# EAGLE design RoverWingPogoBed-V1 (EAGLE 9.2.2)

## Sheet 1 of 2
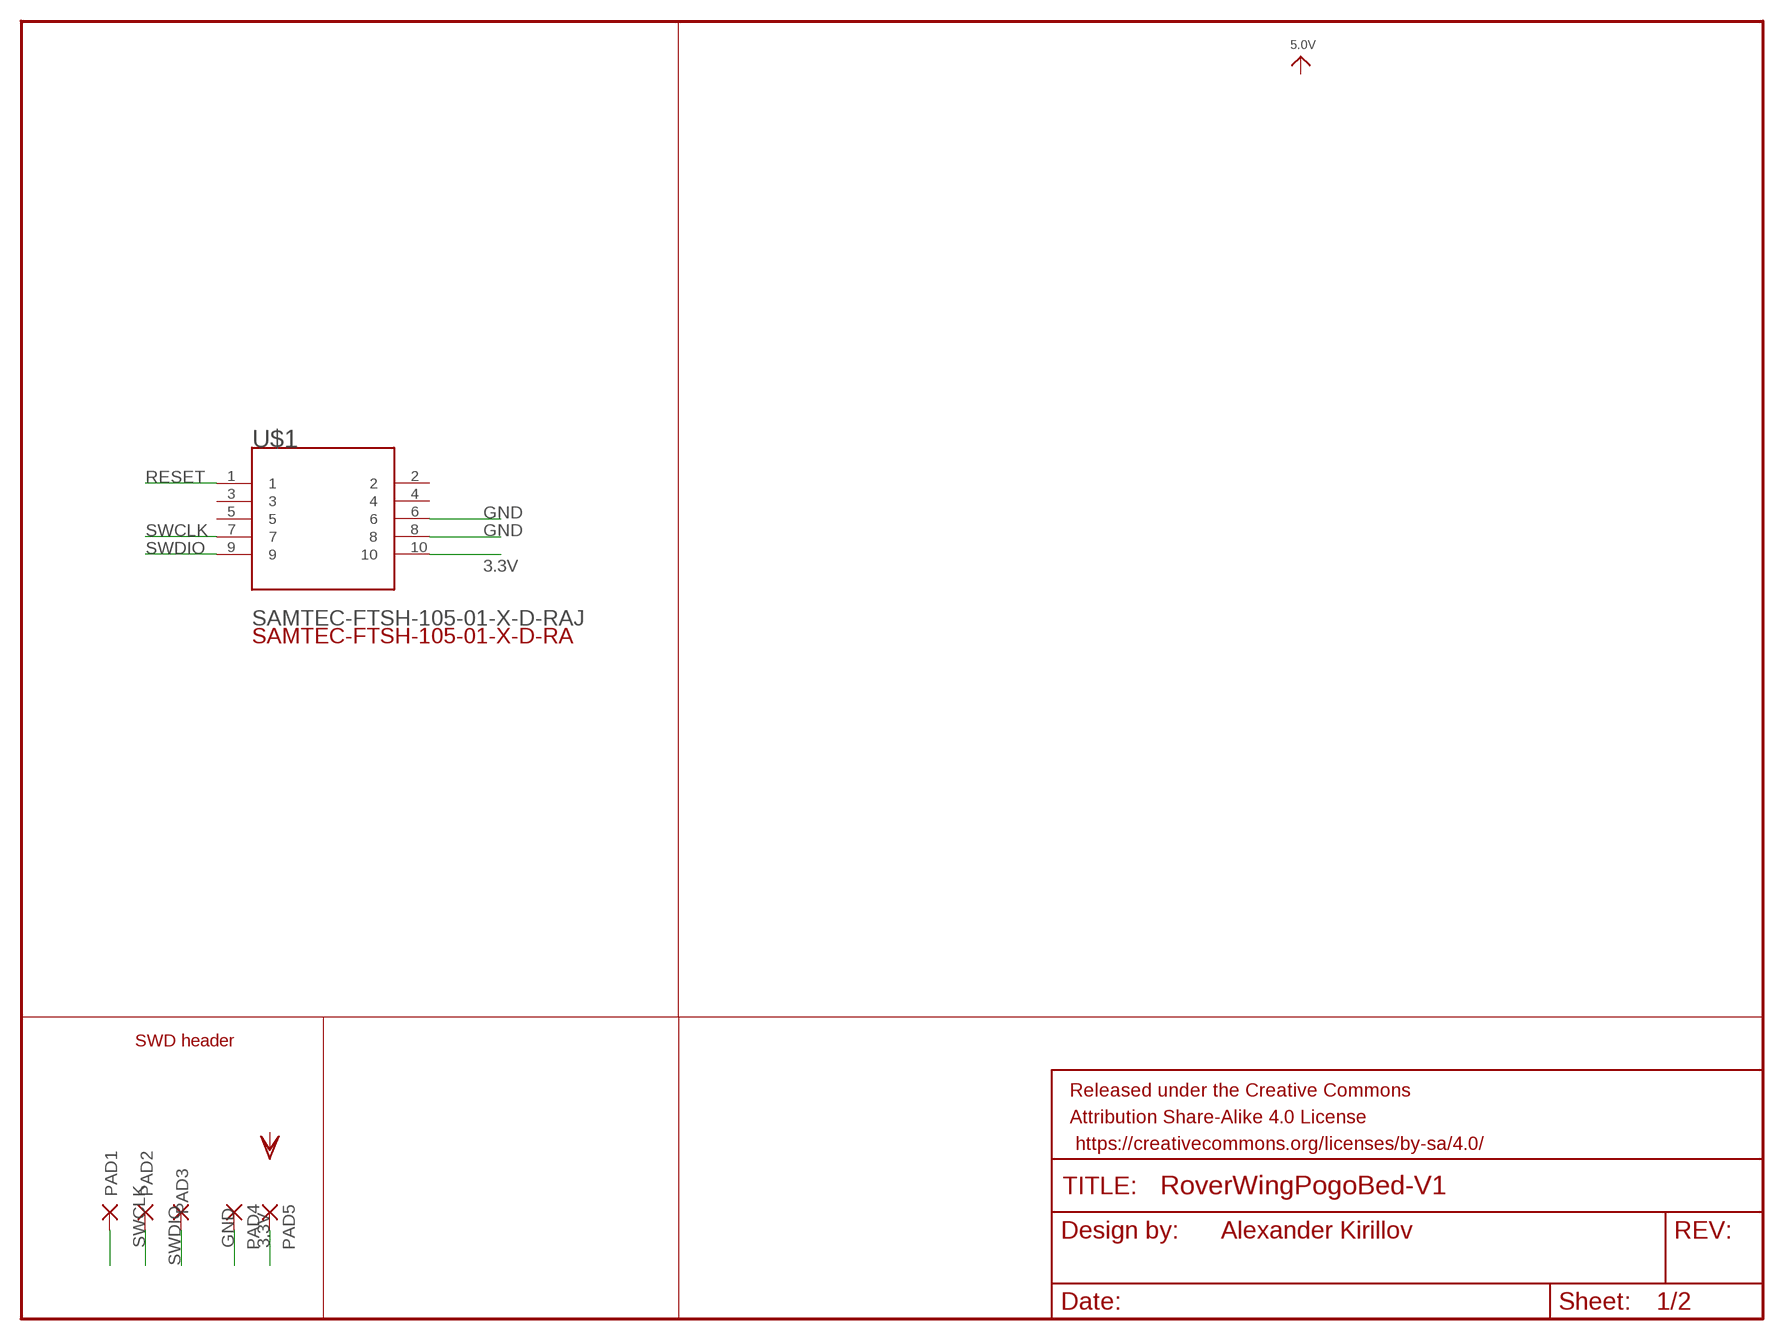
[diagram p0: schematic, sheet 1]

### Parts
FRAME2  FRAME-LETTERNO_PACKAGE  [DUMMY]
PAD1  2,15/1,0  [2,15/1,0]
PAD2  2,15/1,0  [2,15/1,0]
PAD3  2,15/1,0  [2,15/1,0]
PAD4  2,15/1,0  [2,15/1,0]
PAD5  2,15/1,0  [2,15/1,0]
U$1  SAMTEC-FTSH-105-01-X-D-RAJ  [SAMTEC-FTSH-105-01-X-D-RA]

### Nets
3.3V: PAD5.1(P) U$1.10
GND: PAD4.1(P) U$1.6 U$1.8
RESET: PAD1.1(P) U$1.1
SWCLK: PAD2.1(P) U$1.7
SWDIO: PAD3.1(P) U$1.9
Unconnected: U$1.2 U$1.3 U$1.4 U$1.5

### Notes on the sheet
- SWD header
- Alexander Kirillov

## Sheet 2 of 2
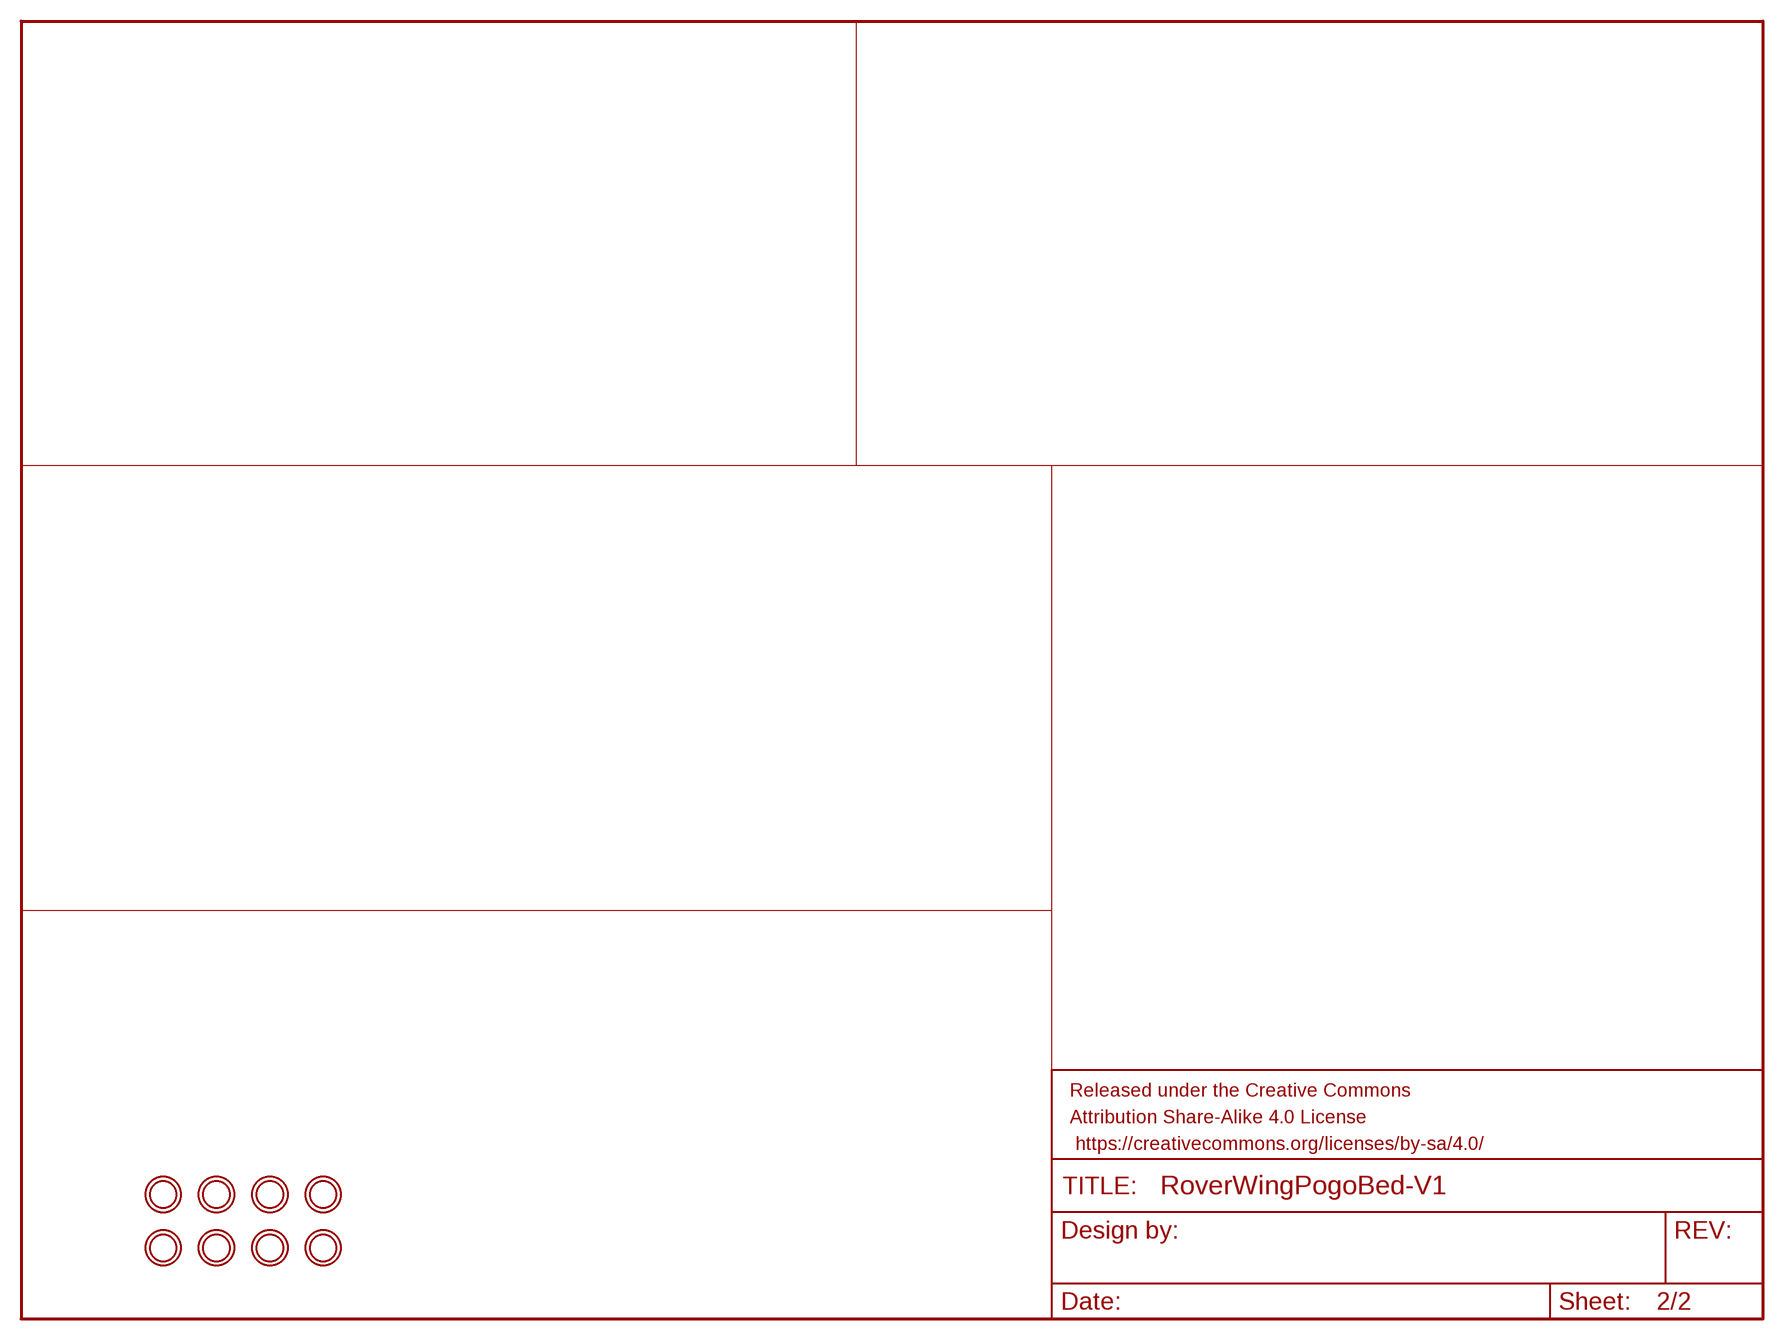
[diagram p1: schematic, sheet 2]

### Parts
FRAME1  FRAME-LETTERNO_PACKAGE  [DUMMY]
U$3  MOUNTINGHOLE3.0_NPH  [MOUNTINGHOLE_3.0_NPH]
U$4  MOUNTINGHOLE3.0_NPH  [MOUNTINGHOLE_3.0_NPH]
U$14  MOUNTINGHOLE3.0_NPH  [MOUNTINGHOLE_3.0_NPH]
U$15  MOUNTINGHOLE3.0_NPH  [MOUNTINGHOLE_3.0_NPH]
U$24  MOUNTINGHOLE3.0_NPH  [MOUNTINGHOLE_3.0_NPH]
U$25  MOUNTINGHOLE3.0_NPH  [MOUNTINGHOLE_3.0_NPH]
U$26  MOUNTINGHOLE3.0_NPH  [MOUNTINGHOLE_3.0_NPH]
U$27  MOUNTINGHOLE3.0_NPH  [MOUNTINGHOLE_3.0_NPH]

## Library data of the parts
FRAME1 FRAME2 = SparkFun-Aesthetics:FRAME-LETTER: Schematic Frame - Letter Standard 8.5x11 US Letter frame; DESIGNER: Nobody; VERSION: v01
PAD1-PAD5 = wirepad:2,15/1,0: THROUGH-HOLE PAD
U$1 = SAMTEC-FTSH-105-01-X-D-RA:SAMTEC-FTSH-105-01-X-D-RA; DESCRIPTION: Conn Unshrouded Header HDR 10 POS 1.27mm Solder RA Thru-Hole Tube; DIGI-KEY_PART_NUMBER: SAM9432-ND; DIGI-KEY_PURCHASE_URL: https://www.digikey.com/product-detail/en/samtec-inc/FTSH-105-01-F-D-RA-K/SAM9432-ND/6678169?utm_source=snapeda&utm_medium=aggregator&utm_campaign=symbol; MF: Samtec Inc.; MP: FTSH-105-01-F-D-RA-K; PACKAGE: None
U$3 U$4 U$14 U$15 U$24-U$27 = CrickitCopy:MOUNTINGHOLE: Mounting Hole For #2 screws (0.086"/2.18mm width, 0.094"/2.4mm hole) use 2.5mm

## Net classes
1 thinpower: width 0.305 mm
2 thickpower: width 0.406 mm

## Board
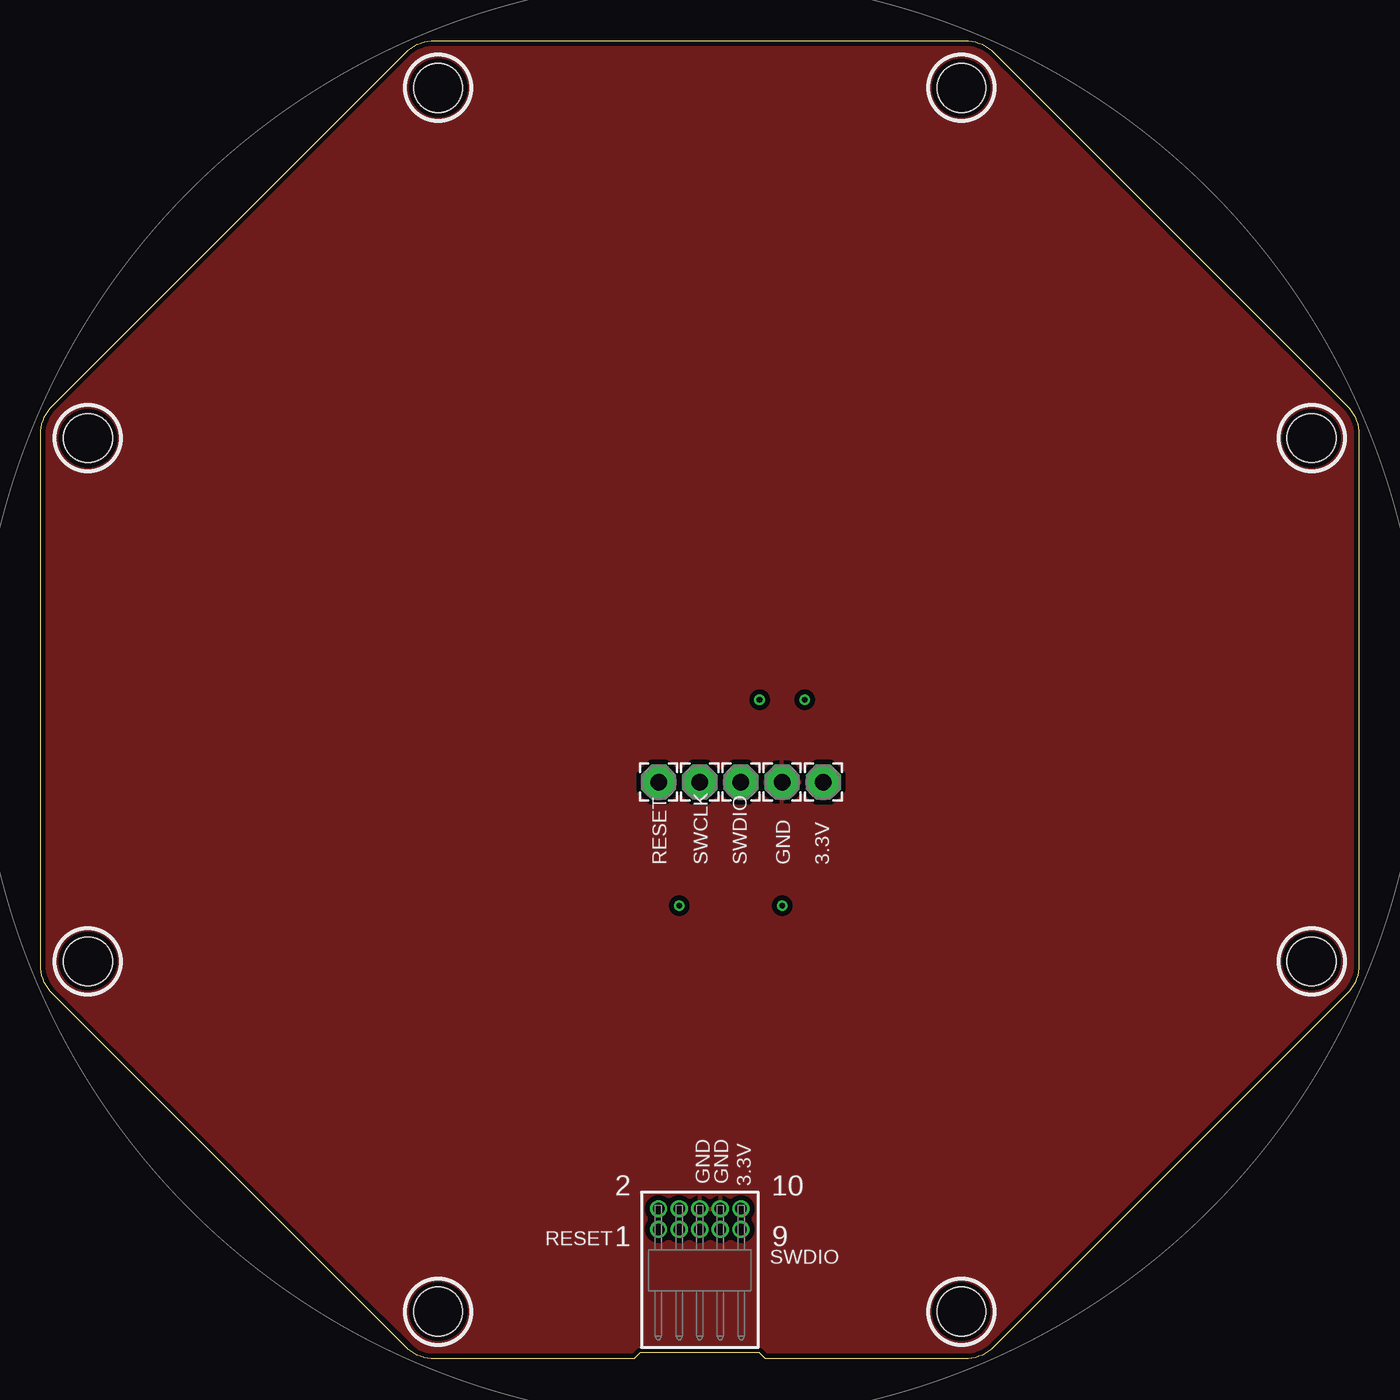
[diagram p2: board, top side]
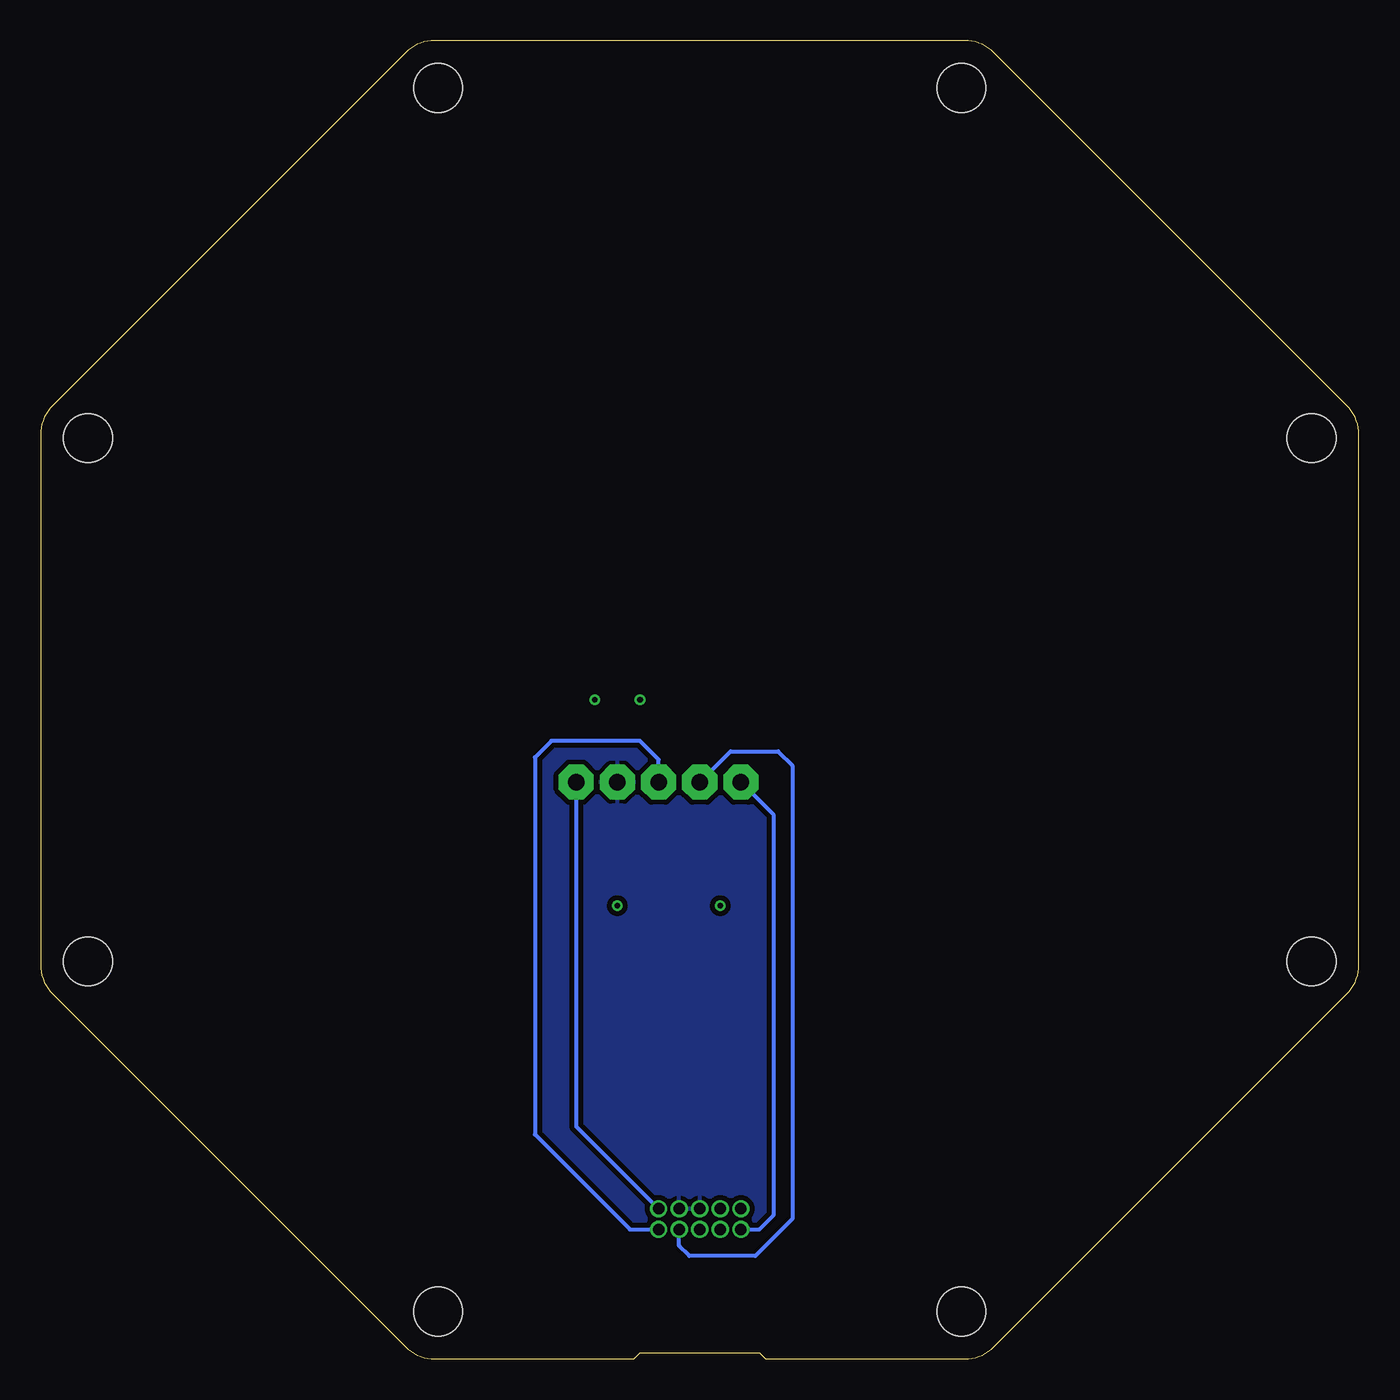
[diagram p3: board, bottom side, seen from below]

Size 81.28 x 81.28 mm. Coordinates in mm from the lower left corner, seen from the top.
Outline: 0,24.29 0,56.99 arc-45 0.74,58.78 22.5,80.54 arc-45 24.29,81.28 56.99,81.28 arc-45 58.78,80.54 80.54,58.78 arc-45 81.28,56.99 81.28,24.29 arc-45 80.54,22.5 58.78,0.74 arc-45 56.99,0 44.7,0 44.32,0.38 36.96,0.38 36.58,0 24.29,0 arc-45 22.5,0.74 0.74,22.5 arc-45 0,24.29
Copper layers (1*16): Top 0.035mm / dielectric 1.5mm / Bottom 0.035mm
Design rules "SeeedStudio_2layer_DRU_no_angle_20140221 *": minimum track width 6mil, minimum drill 12mil, track to track 6mil, track to pad 6mil, pad to pad 6mil, via to via 6mil, smd to smd 0mil, copper to edge 10mil, drill to drill 10mil, minimum pad ring 7mil, minimum via ring 6mil, stop-mask expansion 2mil, vias tented up to drill 100mil, thermal gap 10mil

### Footprints (pad centres in the part's own frame; a part is rotated, then mirrored left to right if it is on the bottom)
2,15/1,0 = drill 1.016 pad 2.159 octagon: 1 0,0
SAMTEC-FTSH-105-01-X-D-RA = drill 0.71 pad 0.762: 1 -2.54,2.527 | drill 0.71 pad 1.067: 2 -2.54,3.797; 3 -1.27,2.527; 4 -1.27,3.797; 5 0,2.527; 6 0,3.797; 7 1.27,2.527; 8 1.27,3.797; 9 2.54,2.527; 10 2.54,3.797
MOUNTINGHOLE_3.0_NPH = hole 3: 0,0

### Placement (x,y rotation side)
FRAME1  76.84,81.15 0 top
FRAME2  77.85,82.17 0 top
PAD1  38.1,35.56 0 top
PAD2  40.64,35.56 0 top
PAD3  43.18,35.56 0 top
PAD4  45.72,35.56 0 top
PAD5  48.26,35.56 0 top
U$1  40.64,5.46 0 top
U$3  24.51,2.92 0 top
U$4  56.77,2.92 0 top
U$14  2.92,24.51 0 top
U$15  2.92,56.77 0 top
U$24  78.36,24.51 0 top
U$25  78.36,56.77 0 top
U$26  24.51,78.36 0 top
U$27  56.77,78.36 0 top

### Tracks (layer width: path | path; a pad name or v marks a point on that pad's centre or on a via)
3.3V
  Bottom 0.254: PAD5.1 48.26,14.34 U$1.10
GND
  pour Bottom (isolate 0.305, rank 2): 23.24,81.28 -0.13,57.4 0.02,22.99 23.5,0.02 58.04,-0.13 81.28,23.11 81.28,57.91 58.04,81.28
  pour Top (isolate 0.305, rank 2): 23.37,81.28 0,57.4 -0.11,32.64 -0.05,23.35 23.75,0.27 58.42,0.12 81.41,23.11 81.41,57.91 58.17,81.28
N$1  (via drill 0.35)
  other vias: 39.37,27.94
N$2  (via drill 0.35)
  other vias: 45.72,27.94
N$3  (via drill 0.35)
  other vias: 44.32,40.64
N$4  (via drill 0.35)
  other vias: 47.12,40.64
RESET
  Bottom 0.254: U$1.1 36.97,7.99 36.07,8.89 36.07,33.53 PAD1.1
SWCLK
  Bottom 0.254: PAD2.1 38.73,37.47 35.81,37.47 34.92,36.58 34.92,8.64 37.21,6.35 41.27,6.35 41.91,6.98 U$1.7
SWDIO
  Bottom 0.254: PAD3.1 43.18,36.96 44.32,38.1 49.78,38.1 50.8,37.08 50.8,13.84 44.95,7.99 U$1.9

### Text on the board
tNames: RESET | SWCLK | SWDIO | GND | 3.3V | GND | GND | 3.3V | RESET | SWDIO